# Altium schematic sheet Drivers.SchDoc
size 457 x 304 mm
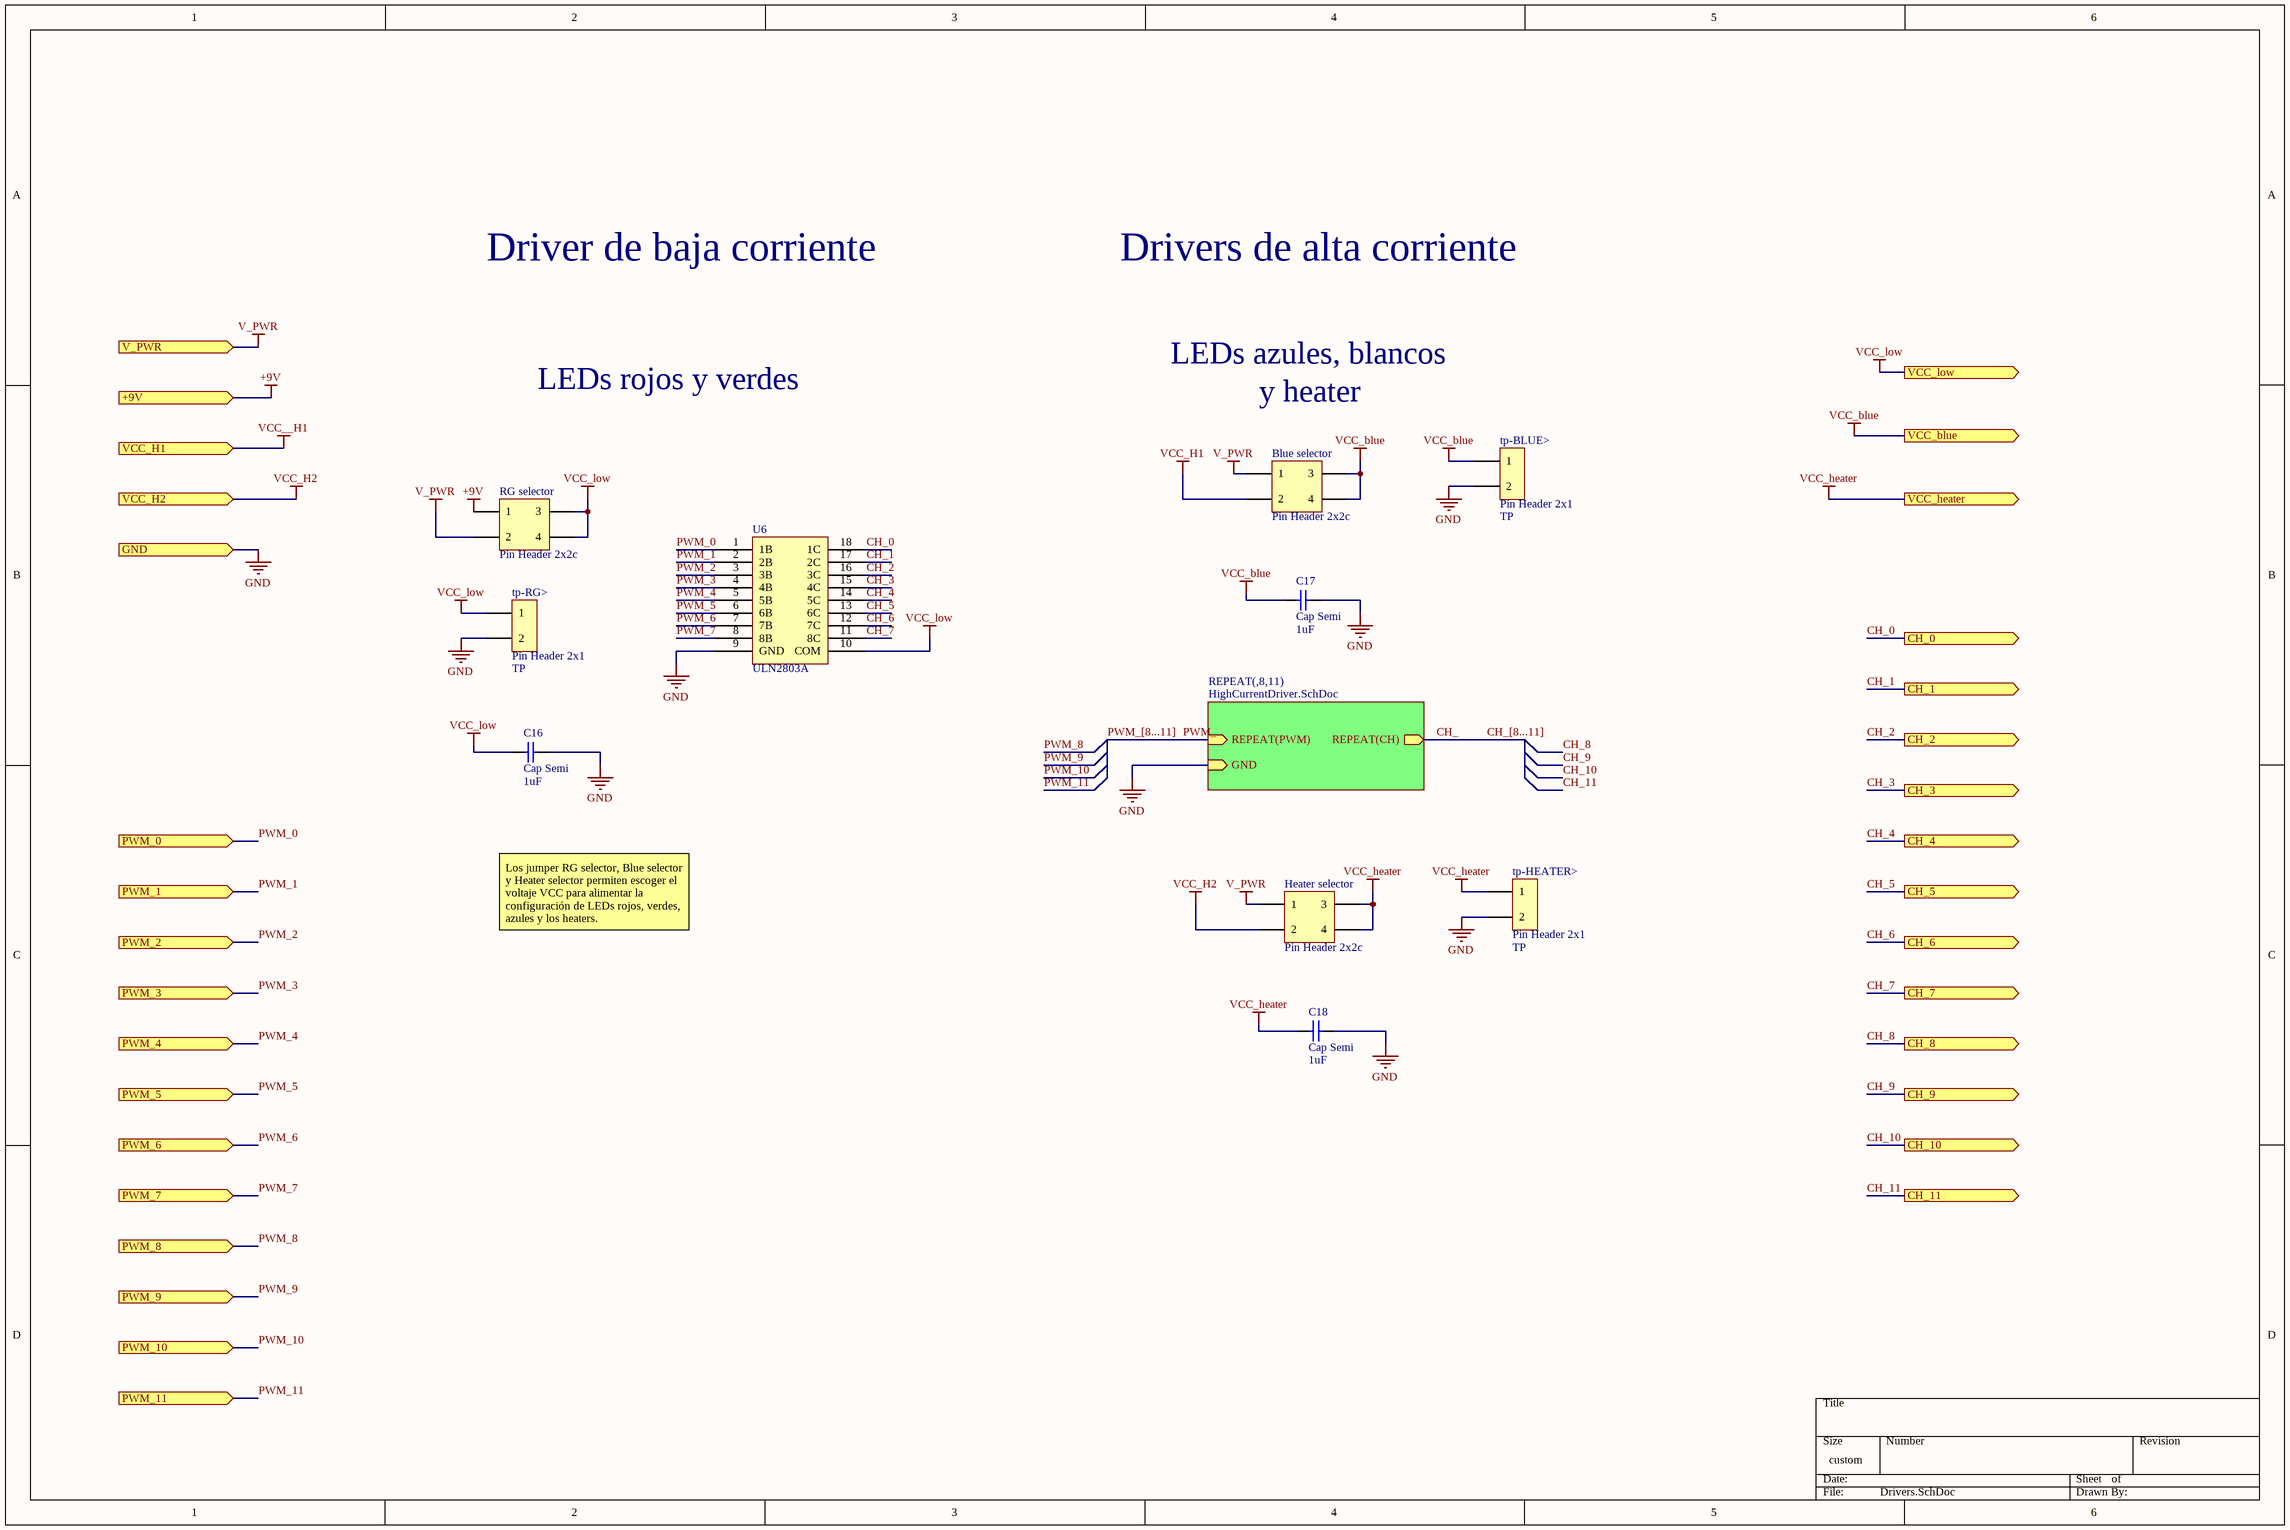
[diagram p0: Drivers.SchDoc]

## Parts
Blue_selector  Pin Header 2x2c  [HDR-TH_4P-P2.54-V-R2-C2-S2.54_A2541WV-2X2P]
C16  Cap Semi  value 1uF  [1608[0603]]
C17  Cap Semi  value 1uF  [1608[0603]]
C18  Cap Semi  value 1uF  [1608[0603]]
Heater_selector  Pin Header 2x2c  [HDR-TH_4P-P2.54-V-R2-C2-S2.54_A2541WV-2X2P]
RG_selector  Pin Header 2x2c  [HDR-TH_4P-P2.54-V-R2-C2-S2.54_A2541WV-2X2P]
tp-BLUE>  Pin Header 2x1  [HDR-TH_P2.54-H-M_A2541WV-2P]
tp-HEATER>  Pin Header 2x1  [HDR-TH_P2.54-H-M_A2541WV-2P]
tp-RG>  Pin Header 2x1  [HDR-TH_P2.54-H-M_A2541WV-2P]
U6  ULN2803A  [SOIC18]

## Sub-sheets
REPEAT(,8,11) = HighCurrentDriver.SchDoc: REPEAT(PWM) (in), GND (in), REPEAT(CH) (out)

## Ports
+9V (in), CH_0 (out), CH_1 (out), CH_2 (out), CH_3 (out), CH_4 (out), CH_5 (out), CH_6 (out), CH_7 (out), CH_8 (out), CH_9 (out), CH_10 (out), CH_11 (out), GND (in), PWM_0 (in), PWM_1 (in), PWM_2 (in), PWM_3 (in), PWM_4 (in), PWM_5 (in), PWM_6 (in), PWM_7 (in), PWM_8 (in), PWM_9 (in), PWM_10 (in), PWM_11 (in), V_PWR (in), VCC_blue (out), VCC_H1 (in), VCC_H2 (in), VCC_heater (out), VCC_low (out)

## Nets
+9V: RG_selector.1 ; port +9V
GND: C16.2 C17.2 C18.2 tp-BLUE>.2 tp-HEATER>.2 tp-RG>.2 U6.9(GND) ; port GND, sheet REPEAT(,8,11)/GND
V_PWR: Blue_selector.1 Heater_selector.1 RG_selector.2 ; port V_PWR
VCC__H1: port VCC_H1
VCC_blue: Blue_selector.3 Blue_selector.4 C17.1 tp-BLUE>.1 ; port VCC_blue
VCC_H1: Blue_selector.2
VCC_H2: Heater_selector.2 ; port VCC_H2
VCC_heater: C18.1 Heater_selector.3 Heater_selector.4 tp-HEATER>.1 ; port VCC_heater
VCC_low: C16.1 RG_selector.3 RG_selector.4 tp-RG>.1 U6.10(COM) ; port VCC_low
CH_: sheet REPEAT(,8,11)/REPEAT(CH)
CH_0: U6.18(1C) ; port CH_0
CH_1: U6.17(2C) ; port CH_1
CH_2: U6.16(3C) ; port CH_2
CH_3: U6.15(4C) ; port CH_3
CH_4: U6.14(5C) ; port CH_4
CH_5: U6.13(6C) ; port CH_5
CH_6: U6.12(7C) ; port CH_6
CH_7: U6.11(8C) ; port CH_7
CH_8: port CH_8
CH_9: port CH_9
CH_10: port CH_10
CH_11: port CH_11
PWM_: sheet REPEAT(,8,11)/REPEAT(PWM)
PWM_0: U6.1(1B) ; port PWM_0
PWM_1: U6.2(2B) ; port PWM_1
PWM_2: U6.3(3B) ; port PWM_2
PWM_3: U6.4(4B) ; port PWM_3
PWM_4: U6.5(5B) ; port PWM_4
PWM_5: U6.6(6B) ; port PWM_5
PWM_6: U6.7(7B) ; port PWM_6
PWM_7: U6.8(8B) ; port PWM_7
PWM_8: port PWM_8
PWM_9: port PWM_9
PWM_10: port PWM_10
PWM_11: port PWM_11

## Buses and harness runs
bus CH_[8...11]
bus PWM_[8...11]

## Notes on the sheet
- Driver de baja corriente
- Drivers de alta corriente
- LEDs rojos y verdes
- LEDs azules, blancos
- y heater
- (near tp-BLUE>) TP
- (near tp-RG>) TP
- Los jumper RG selector, Blue selector y Heater selector permiten escoger el voltaje VCC para alimentar la configuración de LEDs rojos, verdes, azules y los heaters.
- (near tp-HEATER>) TP

## Library data of the parts
Blue_selector Heater_selector RG_selector = Header - 2x2c: Pin Header 4pos, 2 row, 2.54 pitch; Manufacturer: CJT(Changjiang Connectors); Manufacturer Part Number: A2541WV-2x2P; Pitch: 2.54; Supplier 1: LCSC; Supplier Part Number 1: C225517
C16-C18 = Cap Semi: Capacitor (Semiconductor SIM Model); Manufacturer: Samsung Electro-Mechanics; Manufacturer Part Number: CL10A105KB8NNNC; Published: 8-Jun-2000; LatestRevisionDate: 29-May-2009; LatestRevisionNote: IPC-7351 Footprint Added.; PackageReference: C0603; Publisher: Altium Limited; PackageDescription: Chip Capacitor; Supplier 1: LCSC; Supplier Part Number 1: C15849
tp-BLUE> tp-HEATER> tp-RG> = Header - 2x1c: Pin Header 2pos, 1 row, 2.54 pitch; Manufacturer: CJT(Changjiang Connectors); Manufacturer Part Number: A2541WV-2P; Pitch: 2.54; Supplier 1: LCSC; Supplier Part Number 1: C225477
U6 = ULN2803: Darlington transistor array driver SOIC-18_300mi; Manufacturer: Texas instrument; Manufacturer Part Number: ULN2803ADWR; Supplier 1: LCSC; Supplier Part Number 1: C9683; Package: SOIC-18_300mil